# EAGLE design beemos-master (EAGLE 9.0.0)
DELETE: MF
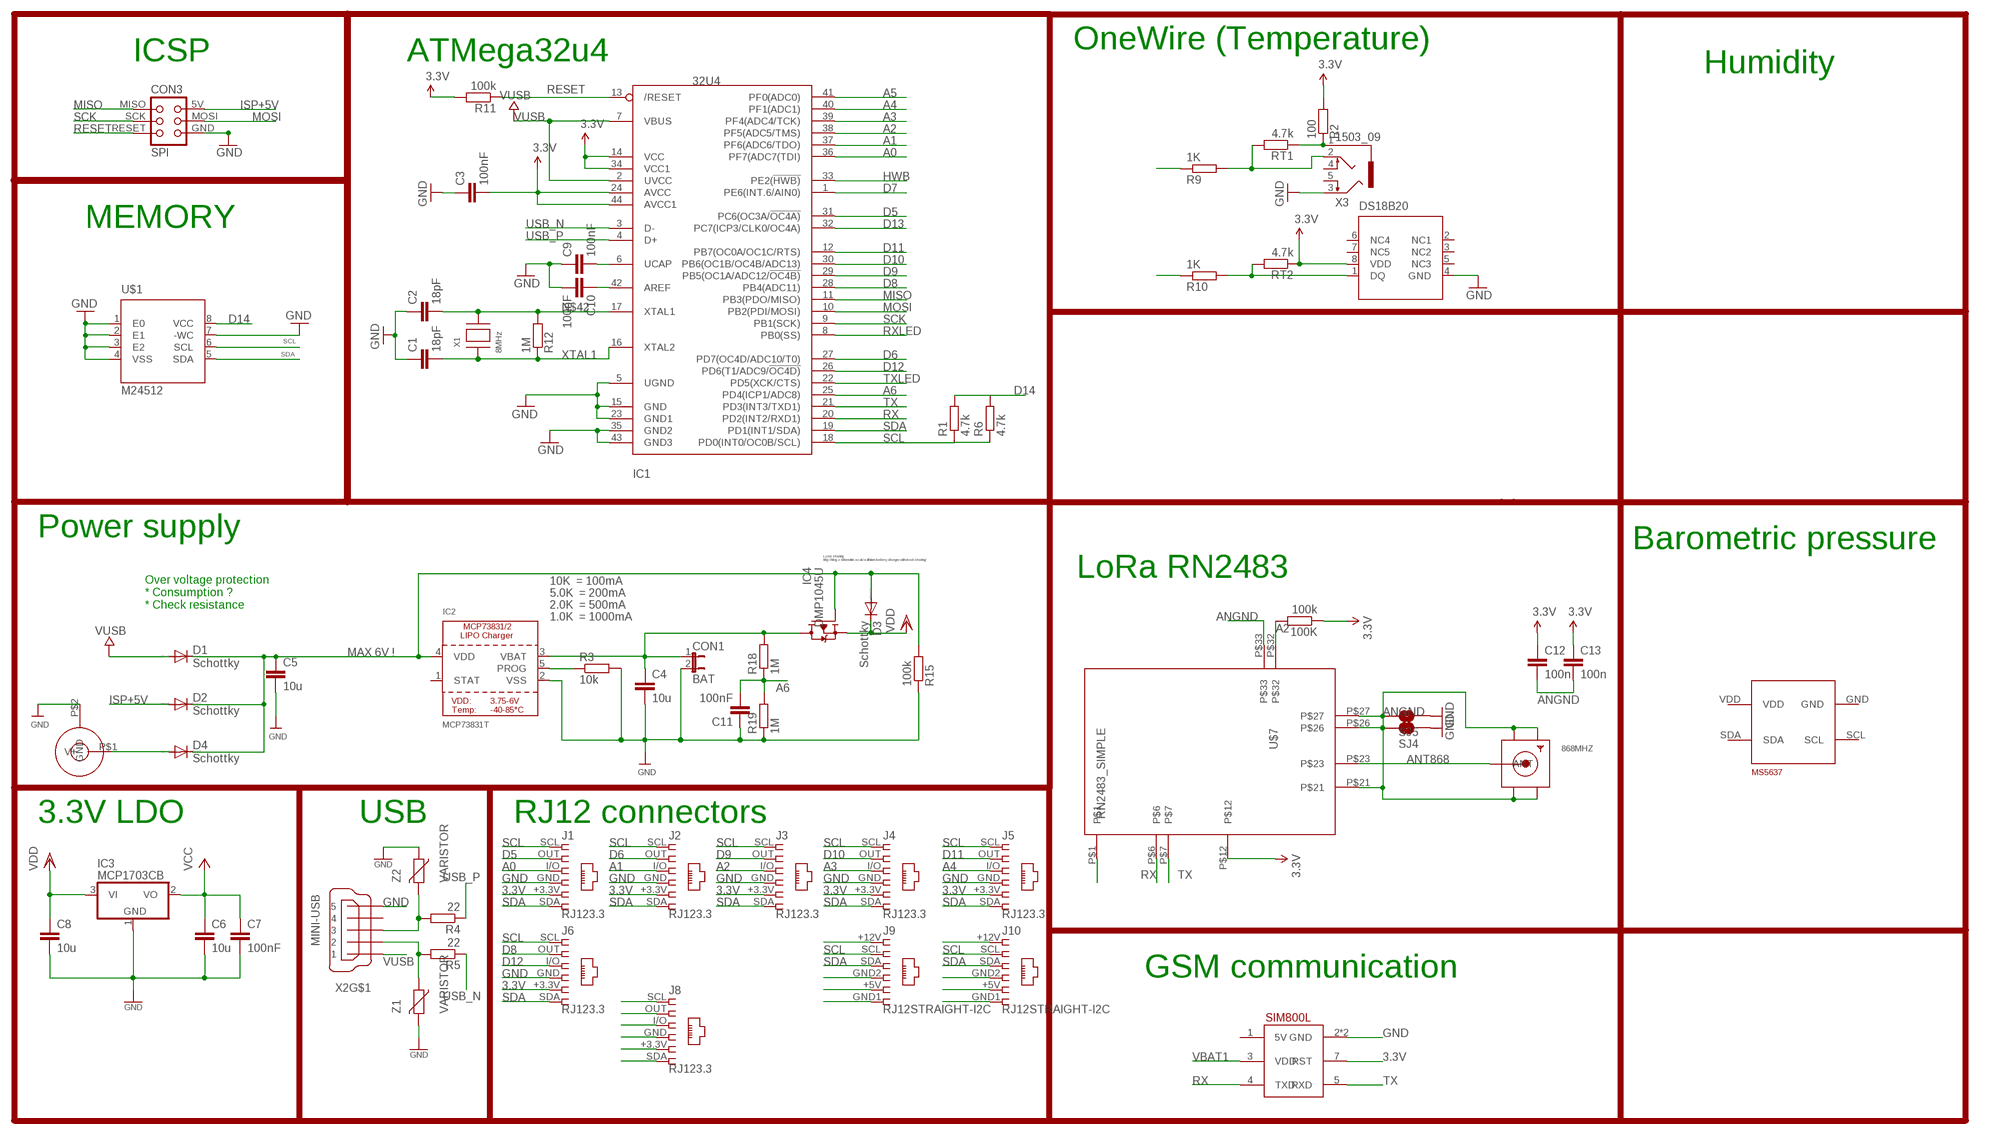
[diagram p0: schematic, sheet 1]

## Parts
100K  100k  R-EU_R0805  [R0805]
868MHZ  SMACONNECTOR_EDGE_UFL  [SMA_EDGELAUNCH_UFL]
C1  18pF  C-EUC0805K  [C0805K]
C2  18pF  C-EUC0805K  [C0805K]
C3  100nF  C-EUC0805K  [C0805K]
C4  10u  C-EUC0805K  [C0805K]
C5  10u  C-EUC0805K  [C0805K]
C6  10u  C-EUC0805K  [C0805K]
C7  100nF  C-EUC0805K  [C0805K]
C8  10u  C-EUC0805K  [C0805K]
C9  100nF  C-EUC0805K  [C0805K]
C10  100nF  C-EUC0805K  [C0805K]
C11  100nF  C-EUC0805K  [C0805K]
C12  100n  C-EUC0805  [C0805]
C13  100n  C-EUC0805  [C0805]
CON1  BAT  JP1E  [JP1]
CON2  JACK_DC_BARREL  [DC_BARREL]
CON3  SPI  TINYISPT  [TC2030-MCP-NL]
D1  Schottky  MBR0520LT  [SOD123]
D2  Schottky  MBR0520LT  [SOD123]
D3  Schottky  MBR0520LT  [SOD123]
D4  Schottky  MBR0520LT  [SOD123]
IC1  32U4  ATMEGA32U4-AU  [TQFP44]
IC2  MCP73831T  MCP73831/2  [SOT23-5]
IC3  MCP1703CB  [SOT23]
IC4  DMP1045U  TRANSISTOR_FET_TSM2301CX  [SOT-23]
IC5  MS5637WIDE  [MS5637WIDE]
J1  RJ123.3  [RJ12-STRAIGHT-3.3]
J2  RJ123.3  [RJ12-STRAIGHT-3.3]
J3  RJ123.3  [RJ12-STRAIGHT-3.3]
J4  RJ123.3  [RJ12-STRAIGHT-3.3]
J5  RJ123.3  [RJ12-STRAIGHT-3.3]
J6  RJ123.3  [RJ12-STRAIGHT-3.3]
J8  RJ123.3  [RJ12-STRAIGHT-3.3]
J9  RJ12STRAIGHT-I2C  [RJ12-STRAIGHT-I2C]
J10  RJ12STRAIGHT-I2C  [RJ12-STRAIGHT-I2C]
R1  4.7k  R-EU_R0805  [R0805]
R2  100  R-EU_R0805  [R0805]
R3  10k  R-EU_R0805  [R0805]
R4  22  R-EU_R0805  [R0805]
R5  22  R-EU_R0805  [R0805]
R6  4.7k  R-EU_R0805  [R0805]
R9  1K  R-EU_R0805  [R0805]
R10  1K  R-EU_R0805  [R0805]
R11  100k  R-EU_R0805  [R0805]
R12  1M  R-EU_R0805  [R0805]
R15  100k  R-EU_R0805  [R0805]
R18  1M  R-EU_R0805  [R0805]
R19  1M  R-EU_R0805  [R0805]
RT1  4.7k  R-EU_R0805  [R0805]
RT2  4.7k  R-EU_R0805  [R0805]
SJ4  JUMPER-PAD-2-NC_BY_TRACE  [PAD-JUMPER-2-NC_BY_TRACE_YES_SILK]
SJ5  JUMPER-PAD-2-NC_BY_TRACE  [PAD-JUMPER-2-NC_BY_TRACE_YES_SILK]
U$1  M24512  [SO8]
U$6  SIM800L  [SIP]
U$7  RN2483_SIMPLE  [RN2483_SIMPLE]
U$8  DS18B20  DS18B20SMALL  [MSOP8]
X1  8MHz  XTALNX6035  [NX6035]
X2  MINI-USB  MINI-USB-SCHIELD-32005-201  [32005-201]
X3  1503_09  [1503_09]
Z1  VARISTOR  VARISTORCN0805  [CT/CN0805]
Z2  VARISTOR  VARISTORCN0805  [CT/CN0805]

## Nets
3.3V [power]: 100K.1 C3.2 C6.1 C7.1 C12.1 C13.1 IC1.14(VCC) IC1.24(AVCC) IC1.34(VCC1) IC1.44(AVCC1) IC3.2(VO) J1.+3.3V J2.+3.3V J3.+3.3V J4.+3.3V J5.+3.3V J6.+3.3V R2.2 R11.2 RT2.1 U$6.7(RST) U$7.P$12 U$8.8(VDD) ; supply symbol labelled VCC
A0: IC1.36(PF7(ADC7(TDI)) J1.I/O
A1: IC1.37(PF6(ADC6/TDO)) J2.I/O
A2: 100K.2 IC1.38(PF5(ADC5/TMS)) J3.I/O U$7.P$32
A3: IC1.39(PF4(ADC4/TCK)) J4.I/O
A4: IC1.40(PF1(ADC1)) J5.I/O
A5: IC1.41(PF0(ADC0))
A6: C11.2 IC1.25(PD4(ICP1/ADC8)) R18.1 R19.2
A7: R9.1
ANGND: 868MHZ.GND@1(GND1) 868MHZ.GND@2(GND2) 868MHZ.GND@3(GND3) 868MHZ.GND@4(GND4) C12.2 C13.2 SJ4.2 SJ5.2 U$7.P$1 U$7.P$21 U$7.P$26 U$7.P$27 U$7.P$33
ANT868: 868MHZ.P(ANT) U$7.P$23
AREF: C10.1 IC1.42(AREF)
D5: IC1.31(PC6(OC3A/!OC4A)) J1.OUT
D6: IC1.27(PD7(OC4D/ADC10/T0)) J2.OUT
D7: IC1.1(PE6(INT.6/AIN0))
D8: IC1.28(PB4(ADC11)) J6.OUT
D9: IC1.29(PB5(OC1A/ADC12/!OC4B)) J3.OUT
D10: IC1.30(PB6(OC1B/OC4B/ADC13)) J4.OUT
D11: IC1.12(PB7(OC0A/OC1C/RTS)) J5.OUT
D12: IC1.26(PD6(T1/ADC9/!OC4D)) J6.I/O
D12*: R10.1
D13: IC1.32(PC7(ICP3/CLK0/OC4A))
D14 [power]: R1.2 R6.2 U$1.8(VCC)
GND [power]: C1.1 C2.1 C3.1 C4.2 C5.2 C6.2 C7.2 C8.2 C9.1 C10.2 C11.1 CON1.2 CON2.P$2(GND) CON3.GND IC1.5(UGND) IC1.15(GND) IC1.23(GND1) IC1.35(GND2) IC1.43(GND3) IC2.2(VSS) IC3.1(GND) J1.GND J2.GND J3.GND J4.GND J5.GND J6.GND R3.2 R15.1 R19.1 SJ4.1 SJ5.1 U$1.1(E0) U$1.2(E1) U$1.3(E2) U$1.4(VSS) U$1.7(-WC) U$6.2(GND) U$6.6(GND) U$8.4(GND) X2.5 X3.3 Z1.2 Z2.1
HWB: IC1.33(PE2(!HWB))
ISP+5V: CON3.5V(VCC) D2.A
MISO: CON3.MISO IC1.11(PB3(PDO/MISO))
MOSI: CON3.MOSI IC1.10(PB2(PDI/MOSI))
N$1: C9.2 IC1.6(UCAP)
N$3: CON2.P$1(V+) D4.A
N$6: IC2.5(PROG) R3.1
N$9 [power]: R10.2 RT2.2 U$8.1(DQ)
N$14 [power]: R2.1 RT1.1 X3.1
N$15: C5.1 D1.C D2.C D3.A D4.C IC2.4(VDD) IC4.1(G) R15.2
N$21 [power]: R9.2 RT1.2 X3.2
N$27: J8.SCL
N$28: J8.OUT
N$29: J8.I/O
N$30: J8.GND
N$31: J8.+3.3V
N$32: J8.SDA
N$33: J9.+12V
N$36: J9.GND2
N$37: J9.+5V
N$40: J9.GND1
N$42: C2.2 IC1.17(XTAL1) R12.2 X1.P$2
N$44: J10.+12V
N$47: J10.GND2
N$48: J10.+5V
N$49: J10.GND1
RESET: CON3.RESET IC1.13(/RESET) R11.1
RX: IC1.20(PD2(INT2/RXD1)) U$6.4(TXD) U$7.P$6
RXLED: IC1.8(PB0(SS))
SCK: CON3.SCK IC1.9(PB1(SCK))
SCL: IC1.18(PD0(INT0/OC0B/SCL)) J1.SCL J2.SCL J3.SCL J4.SCL J5.SCL J6.SCL J9.SCL J10.SCL R1.1 R6.1 U$1.6(SCL)
SDA: IC1.19(PD1(INT1/SDA)) J1.SDA J2.SDA J3.SDA J4.SDA J5.SDA J6.SDA J9.SDA J10.SDA U$1.5(SDA)
TX: IC1.21(PD3(INT3/TXD1)) U$6.5(RXD) U$7.P$7
TXLED: IC1.22(PD5(XCK/CTS))
USB_N: IC1.3(D-) R5.1
USB_P: IC1.4(D+) R4.1
USBC_N: R5.2 X2.2 Z1.1
USBC_P: R4.2 X2.3 Z2.2
VBAT1: C4.1 CON1.1 IC2.3(VBAT) IC4.3(D) R18.2 U$6.3(VDD)
VDD [power]: C8.1 D3.C IC3.3(VI) IC4.2(S)
VUSB: D1.A IC1.2(UVCC) IC1.7(VBUS) X2.1
XTAL1: C1.2 IC1.16(XTAL2) R12.1 X1.P$1
Unconnected: IC2.1(STAT) IC5.GND IC5.SCL IC5.SDA IC5.VDD U$6.1(5V) U$8.2(NC1) U$8.3(NC2) U$8.5(NC3) U$8.6(NC4) U$8.7(NC5) X2.4 X2.M1(S:S1) X2.M2(S:S2) X2.M3(S:S3) X2.M4(S:S4) X3.4 X3.5

## Notes on the sheet
- OneWire (Temperature)
- ICSP | ATMega32u4
- Humidity
- MEMORY
- Power supply
- Barometric pressure
- Load sharing:
  http://blog.zakkemble.co.uk/a-lithium-battery-charger-with-load-sharing/
- LoRa RN2483
- 10K  = 100mA
- 5.0K  = 200mA
- Over voltage protection
  * Consumption ?
  * Check resistance
- 2.0K  = 500mA
- 1.0K  = 1000mA
- MAX 6V !
- 3.3V LDO | USB | RJ12 connectors
- GSM communication

## Library data of the parts
100K R1 R2 R6 R9 R10 = rcl:R-EU_: RESISTOR, European symbol
868MHZ = sma_end_launch:SMACONNECTOR: SMA Connector 90° DIP SMA Connector, 50 Ohm (4UConnector: 07259)
C1 C2 = rcl:C-EU: CAPACITOR, European symbol; ELECROW: C1797; LCSC: C1797; MPN: 77-VJ1206A180JXXPBC; SPICEPREFIX: C
C3 C7 C9-C11 = rcl:C-EU: CAPACITOR, European symbol; ELECROW: C49678; LCSC: C49678; MPN: 80-C1206C104K5R; SPICEPREFIX: C
C4-C6 C8 = rcl:C-EU: CAPACITOR, European symbol; ELECROW: C15850; LCSC: C15850; MPN: 77-VJ1206V106ZXQTBC; SPICEPREFIX: C
C12 C13 = rcl:C-EU: CAPACITOR, European symbol
CON1 = jumper:JP1E: JUMPER
CON2 = lpatiny:JACK_DC_BARREL
CON3 = lpatiny:TINYISP: CONNECTOR
D1-D4 = diode:MBR0520LT: SCHOTTKY BARRIER RECTIFIER Source: http://onsemi.com .. MBR0520LT1-D.pdf; LCSC: C82544; MPN: 621-1N5819HW-F
IC1 = adafruit:ATMEGA32U4: http://www.ladyada.net/library/eagle; LCSC: C44854; MPN: 556-ATMEGA32U4RC-AU
IC2 = microbuilder:MCP73831/2: MCP73831/2 LIPO Charger VDD: 3.75 - 6V Temp -40 - 85°C Programmable Charge Rate: 15-500mA NOTE: STAT is a tri-state logic output on the MCP73831 and an open-drain output on the MCP73832. SOT23-5 with 4.2V output and tri-state logic on STAT = MCP73831T-2ACI/OT; LCSC: C14879; MPN: 579-MCP73831T-3ACIOT
IC3 = linear:MCP1703: 250 mA, 16V, Low Quiescent Current LDO Regulator Source: http://ww1.microchip.com/downloads/en/DeviceDoc/22049b.pdf; LCSC: C53352
IC4 = dp_devices:TRANSISTOR_FET_TSM2301CX: 20V P-Channel Enhancement Mode MOSFET; LCSC: C96613; MPN: 621-DMP1045U-7
IC5 = MS5637:MS5637: Le MS563702BA03-50 est un Micro Altimètre ultra compact optimisé pour des applications d'altimètre et de baromètre dans des téléphones portables et des tablettes. La résolution d'altitude au niveau de la mer est de 13cm d'air. Le module de capteur comprend un capteur de pression haute linéarité et un CAN ΔΣ 24 bits ultra faible puissance avec des coefficients internes calibrés en usine. Il fournit une valeur numérique de pression et de température précise de 24 bits et différents modes de fonctionnement qui permettent à l'utilisateur d'optimiser la vitesse de conversion et la consommation de courant. La sortie de température à haute résolution permet la mise en œuvre d'une fonction altimètre / thermomètre sans capteur supplémentaire. Il peut être interfacé avec pratiquement tous les microcontrôleurs à interface I²C-bus. Le protocole de communication est simple, sans avoir à programmer des registres internes dans l'appareil. Faibles dimensions de 3 x 3 x 0.9mm³ pour une intégratio Module haute résolution, 13cm Capteur de pression numérique intégré (CAN ΔΣ 24 bits) Interface I²C Plage de pression étendue de 10 à 2000mbar Conversion rapide jusqu'à 0.5ms Faible consommation, 0.6µA (veille <=0.1µA à 25°C) Aucun composant externe (oscillateur interne)
J1-J6 J8-J10 = lpatiny:RJ12: CORCOM Modular RJ Jacks No Shield Source: www.tycoelectronics.com .. ENG_DS_1654001_1099_RJ_L_0507.pdf
R3 = rcl:R-EU_: RESISTOR, European symbol; ELECROW: C17414; LCSC: C17414
R4 = rcl:R-EU_: RESISTOR, European symbol; ELECROW: C17561; LCSC: C17561
R5 = rcl:R-EU_: RESISTOR, European symbol; ELECROW: C17561; LCSC: C17561; SPICEPREFIX: R
R11 = rcl:R-EU_: RESISTOR, European symbol; ELECROW: C17407; LCSC: C17407; MPN: RC1206FR-07100KL; SPICEPREFIX: R
R12 R18 R19 = rcl:R-EU_: RESISTOR, European symbol; ELECROW: C17514; LCSC: C17514
R15 = rcl:R-EU_: RESISTOR, European symbol; ELECROW: C17407; LCSC: C17407; MPN: RC1206FR-07100KL
RT1 RT2 = resistor:R-EU_: RESISTOR, European symbol
SJ4 SJ5 = SparkFun-Passives:JUMPER-PAD-2-NC_BY_TRACE
U$1 = lpatiny:M24512
U$6 = SIM800L:SIM800L: SIM800L Blue EVB Board with Level Translation and diode dropper.
U$7 = Octanis1_bioreactorPort:RN2483_SIMPLE
U$8 = lpatiny:DS18B20
X1 = lpatiny:XTAL: Low cost SMT crystals, no capacitors included http://www.ladyada.net/library/eagle; LCSC: C122522; MPN: 729-F60800010
X2 = con-cypressindustries:MINI-USB-SCHIELD-: MINI USB-B Conector Source: www.cypressindustries.com; LCSC: C46391; MPN: 649-10033526-N3212LF
X3 = con-lumberg:1503_09: Jack connectors according to JISC 6560, 3.5 mm Klinkeneinbaukupplung nach JISC 6560, 3,5 mm, 3-polig/ stereo, abgewinkelte Ausführung, mit 2 Öffnern und Lötaugen, für Leiterplatten Rückseitenmontage Source: http://www.lumberg.com/Produkte/PDFs/1503_09.pdf; OC_FARNELL: 1243244; OC_NEWARK: unknown
Z1 Z2 = varistor:VARISTOR: VARISTOR; LCSC: C79709

## Net classes
0 default: width 0.203 mm, clearance 0.25 mm
1 power: width 0.203 mm, drill 0.305 mm, clearance 0.25 mm
2 VIN: width 0.406 mm, clearance 0.25 mm
3 fine: width 0.406 mm, clearance 0.25 mm
4 aref: width 0.406 mm, clearance 0.25 mm

## Board
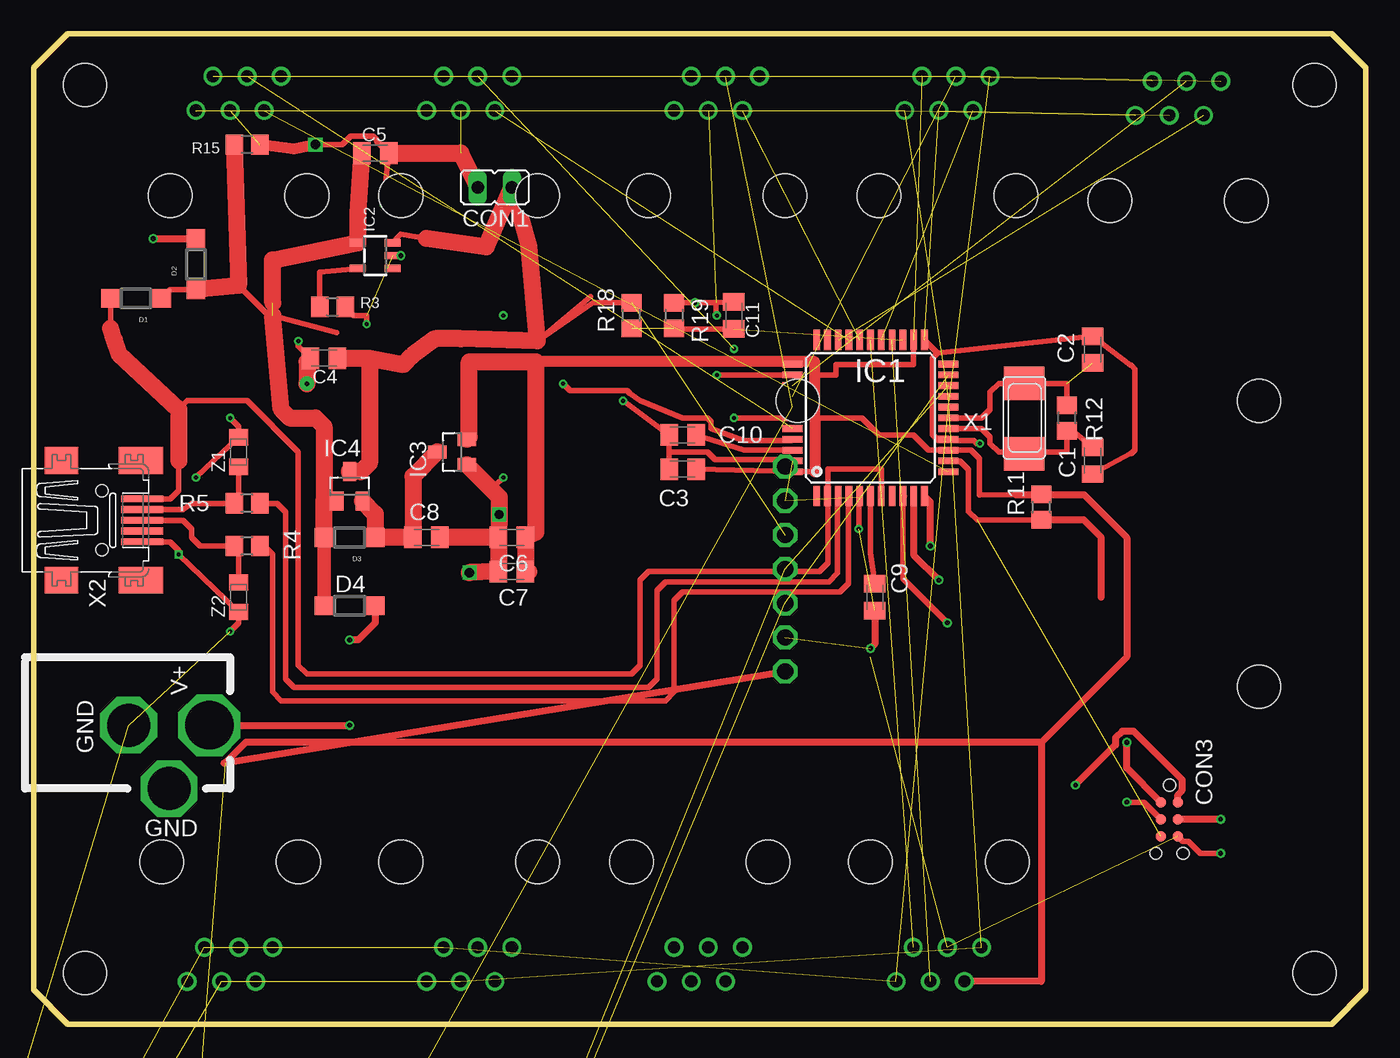
[diagram p1: board, top side]
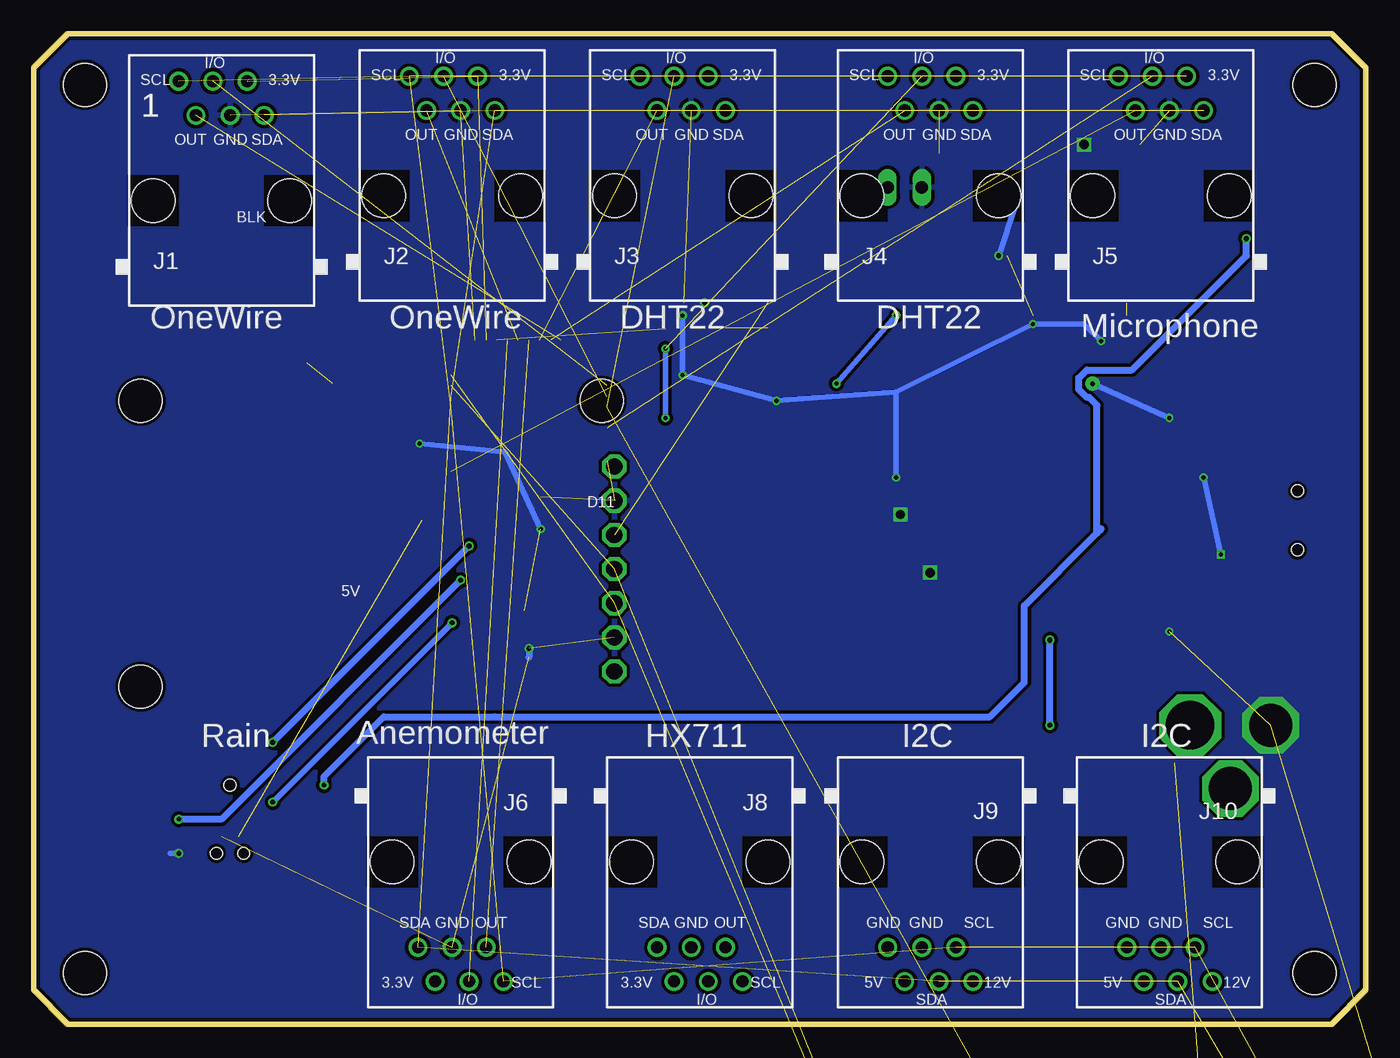
[diagram p2: board, bottom side, seen from below]

Size 99.06 x 73.66 mm. Coordinates in mm from the lower left corner, seen from the top.
Outline: 99.06,71.12 99.06,2.54 96.52,0 2.54,0 0,2.54 0,71.12 2.54,73.66 96.52,73.66 99.06,71.12
Copper layers (1*16): Top 0.035mm / dielectric 0.2mm / Bottom 0.035mm
Design rules "SeeedStudio_DRU_no_angle_20130527 *": minimum track width 6mil, minimum drill 12mil, track to track 6mil, track to pad 6mil, pad to pad 6mil, via to via 6mil, smd to smd 0mil, copper to edge 10mil, drill to drill 10mil, minimum pad ring 6mil, minimum via ring 6mil, stop-mask expansion 2mil, vias tented up to drill 25mil, thermal gap 10mil
Holes 3.2 mm at 95.25,69.85 95.25,3.81 3.81,69.85 3.81,3.81

### Footprints (pad centres in the part's own frame; a part is rotated, then mirrored left to right if it is on the bottom)
R0805 = smd 1.3 x 1.5: 1 -0.95,0; 2 0.95,0
SMA_EDGELAUNCH_UFL = smd 4.064 x 1.524: GND@1 2.032,-2.54; GND@2 2.032,2.54 | smd 4.064 x 1.524 bottom: GND@3 2.032,2.54; GND@4 2.032,-2.54 | smd 2.032 x 1.016: P 3.048,0
C0805K = smd 1.3 x 1.6: 1 -1,0; 2 1,0
C0805 = smd 1.3 x 1.5: 1 -0.95,0; 2 0.95,0
JP1 = drill 0.914 long: 1 0,-1.27; 2 0,1.27
DC_BARREL = drill 3.6 pad 4.5 octagon: P$1 0,13.7 | drill 3.2 pad 4.064 octagon: P$2 0,7.7; P$3 4.7,10.7
TC2030-MCP-NL = smd 0.787 x 0.787: 5V 1.27,0.635; GND 3.81,0.635; MISO 1.27,-0.635; MOSI 2.54,0.635; RESET 3.81,-0.635; SCK 2.54,-0.635 | hole 0.889: 0,0; 5.08,-1.016; 5.08,1.016
SOD123 = smd 1.4 x 1.4: A 1.9,0; C -1.9,0
TQFP44 = smd 1.5 x 0.5: 1 -5.8,4; 2 -5.8,3.2; 3 -5.8,2.4; 4 -5.8,1.6; 5 -5.8,0.8; 6 -5.8,0; 7 -5.8,-0.8; 8 -5.8,-1.6; 9 -5.8,-2.4; 10 -5.8,-3.2; 11 -5.8,-4; 23 5.8,-4; 24 5.8,-3.2; 25 5.8,-2.4; 26 5.8,-1.6; 27 5.8,-0.8; 28 5.8,0; 29 5.8,0.8; 30 5.8,1.6; 31 5.8,2.4; 32 5.8,3.2; 33 5.8,4 | smd 0.5 x 1.5: 12 -4,-5.8; 13 -3.2,-5.8; 14 -2.4,-5.8; 15 -1.6,-5.8; 16 -0.8,-5.8; 17 0,-5.8; 18 0.8,-5.8; 19 1.6,-5.8; 20 2.4,-5.8; 21 3.2,-5.8; 22 4,-5.8; 34 4,5.8; 35 3.2,5.8; 36 2.4,5.8; 37 1.6,5.8; 38 0.8,5.8; 39 0,5.8; 40 -0.8,5.8; 41 -1.6,5.8; 42 -2.4,5.8; 43 -3.2,5.8; 44 -4,5.8
SOT23-5 = smd 0.55 x 1.2: 1 -0.95,-1.3; 2 0,-1.3; 3 0.95,-1.3; 4 0.95,1.3; 5 -0.95,1.3
SOT23 = smd 1 x 1.4: 1 -0.95,-1.1; 2 0.95,-1.1; 3 0,1.1
SOT-23 = smd 1 x 1.4: 1 -0.95,-1.1; 2 0.95,-1.1; 3 0,1.1
MS5637WIDE = smd 1.524 x 1.524: GND 1.254,1.254; SCL 1.254,-1.254; SDA -1.254,-1.254; VDD -1.254,1.254
RJ12-STRAIGHT-3.3 = drill 0.9 pad 1.4: +3.3V 1.905,8.89; GND 0.635,6.35; I/O -0.635,8.89; OUT -1.905,6.35; SCL -3.175,8.89; SDA 3.175,6.35 | hole 3.251: -5.08,0; 5.08,0
RJ12-STRAIGHT-I2C = drill 0.9 pad 1.4: +5V 1.905,8.89; +12V -3.175,8.89; GND1 3.175,6.35; GND2 0.635,6.35; SCL -1.905,6.35; SDA -0.635,8.89 | hole 3.251: -5.08,0; 5.08,0
PAD-JUMPER-2-NC_BY_TRACE_YES_SILK = smd 0.635 x 1.27: 1 -0.508,0; 2 0.508,0
SO8 = smd 0.66 x 2.032: 1 -3.81,-3.073; 2 -2.54,-3.073; 3 -1.27,-3.073; 4 0,-3.073; 5 0,3.073; 6 -1.27,3.073; 7 -2.54,3.073; 8 -3.81,3.073
SIP = drill 1.2 octagon: 1 38.1,19.24; 2 38.1,16.7; 3 38.1,14.16; 4 38.1,11.62; 5 38.1,9.08; 6 38.1,6.54; 7 38.1,4 | hole 3.2: 2.87,24.13; 2.87,2.87; 37.16,24.13
RN2483_SIMPLE = smd 1.524 x 1.016: P$1 8.89,-11.43; P$6 8.89,-5.08; P$7 8.89,-3.81; P$12 8.89,2.54; P$32 -8.89,7.62; P$33 -8.89,8.89 | smd 1.016 x 1.524: P$21 3.81,13.97; P$23 1.27,13.97; P$26 -2.54,13.97; P$27 -3.81,13.97
MSOP8 = smd 0.45 x 1: 1 -0.975,-2.05; 2 -0.325,-2.05; 3 0.325,-2.05; 4 0.975,-2.05; 5 0.975,2.05; 6 0.325,2.05; 7 -0.325,2.05; 8 -0.975,2.05
NX6035 = smd 2.5 x 3: P$1 2.665,0; P$2 -2.565,0
32005-201 = smd 3.1 x 0.5: 1 3,1.6; 2 3,0.8; 3 3,0; 4 3,-0.8; 5 3,-1.6 | smd 2.5 x 2: M1 -3,-4.45; M2 -3,4.45 | smd 3.3 x 2: M3 2.9,4.45; M4 2.9,-4.45 | hole 0.9: 0,2.2; 0,-2.2
1503_09 = drill 0.8 pad 1.2 long: 1 0,-2.1; 2 -4.55,-5.4; 3 5.05,-9.9; 4 -4,-13.1; 5 2.65,-8.5
CT/CN0805 = smd 1.2 x 1.4: 1 -1.1,0; 2 1.1,0

### Placement (x,y rotation side)
100K  6.99,-99.06 0 top  (outside the outline)
868MHZ  -4.45,-103.5 0 top  (outside the outline)
C1  78.74,41.91 90 top
C2  78.74,50.16 270 top
C3  48.26,41.27 0 top
C4  21.59,49.53 180 top
C5  25.4,64.77 0 top
C6  35.56,36.2 180 top
C7  35.56,33.66 180 top
C8  29.21,36.2 0 top
C9  62.55,31.75 90 top
C10  48.26,43.81 180 top
C11  52.07,52.7 270 top
C12  13.34,-99.06 0 top  (outside the outline)
C13  -11.43,-114.94 0 top  (outside the outline)
CON1  34.29,62.23 90 top
CON2  -0.64,22.23 270 top
CON3  84.45,17.78 270 top
D1  7.62,53.98 180 top
D2  12.06,56.52 90 top
D3  23.5,36.2 180 top
D4  23.5,31.11 0 top
IC1  62.23,45.09 90 top
IC2  25.4,57.15 90 top
IC3  31.11,42.55 90 top
IC4  23.5,40.01 0 top
IC5  -10.16,-156.21 0 top  (outside the outline)
J1  85.09,61.23 0 bottom
J2  67.94,61.59 0 bottom
J3  50.8,61.59 0 bottom
J4  32.38,61.59 0 bottom
J5  15.24,61.59 0 bottom
J6  67.31,12.06 180 bottom
J8  49.53,12.06 180 bottom
J9  32.38,12.06 180 bottom
J10  14.61,12.06 180 bottom
R1  -11.43,-57.15 0 top  (outside the outline)
R2  5.71,-150.5 0 top  (outside the outline)
R3  22.23,53.34 0 top
R4  15.88,35.56 180 top
R5  15.88,38.73 180 top
R6  -11.43,-63.5 0 top  (outside the outline)
R9  10.79,-150.5 0 top  (outside the outline)
R10  0,-150.5 0 top  (outside the outline)
R11  74.93,38.44 90 top
R12  76.83,45.09 90 top
R15  15.88,65.41 180 top
R18  44.45,52.7 90 top
R19  47.62,52.7 270 top
RT1  -11.43,-150.5 0 top  (outside the outline)
RT2  -5.71,-150.5 0 top  (outside the outline)
SJ4  -6.35,-113.67 0 top  (outside the outline)
SJ5  -3.17,-113.67 0 top  (outside the outline)
U$1  -6.99,-35.56 0 top  (outside the outline)
U$6  93.98,22.23 0 bottom
U$7  -2.54,-83.19 0 top  (outside the outline)
U$8  11.43,-123.19 0 top  (outside the outline)
X1  73.66,45.09 270 top
X2  5.08,37.47 0 top
X3  -3.17,-127.64 0 top  (outside the outline)
Z1  15.24,42.55 90 top
Z2  15.24,31.75 90 top

### Tracks (layer width: path | path; a pad name or v marks a point on that pad's centre or on a via)
3.3V  (12 unrouted)
  Top 0.406: R11.2 73.03,39.37 70.32,39.34 70.32,42.05 69.69,42.69 IC1.14 66.53,42.69 65.41,43.81 62.87,43.81 61.59,45.09 58.08,45.09 | 58.12,42.55 58.08,41.09 IC1.44 C3.2 | 58.12,42.55 58.26,48.26 | 58.26,48.26 58.26,49.09 IC1.34 | IC1.24 65.41,50.88 65.41,49.06 59.66,49.06 59.66,48.26 58.26,48.26 | 58.25,42.69 58.12,42.55
  Top 0.508: 73.03,39.37 78.1,39.37 81.28,36.2 81.28,27.3 74.93,20.95 | U$6.7 14.14,19.41 14.23,19.41 15.77,20.95 74.93,20.95 | 74.93,20.95 74.93,3.17 J6.+3.3V
  Top 0.813: 37.34,49.26 58.08,49.26 58.08,45.09 58.08,41.09
  Top 1.27: 36.83,33.66 C7.1 C6.1 37.34,36.57 37.34,49.26 32.38,49.26 32.38,43.66 IC3.2 | 74.93,39.37 R11.2
A0  (1 unrouted)
A1  (1 unrouted)
A2  (3 unrouted)
A3  (via drill 0.3)  (1 unrouted)
  Top 0.406: 52.07,50.16 v52.07,50.22 | v52.07,45.09 IC1.39
  Bottom 0.406: v52.07,50.22 v52.07,45.09
A4  (1 unrouted)
  Top 0.406: 56.43,44.32 IC1.40
A5  (via drill 0.3)
  Top 0.406: IC1.41 56.34,43.39 52.77,43.39 50.36,44.3 50.36,44.8 50.1,45.07 48.28,45.07 48.26,45.09 45.09,46.35 44.33,46.91 44.13,47.11 39.88,47.11 v39.37,47.62
  Bottom 0.406: v39.37,47.62 v34.92,52.7
A6  (2 unrouted)
  Top 0.406: C11.2 47.67,51.7 R19.2
ANGND  (12 unrouted)
ANT868  (1 unrouted)
AREF
  Top 0.406: IC1.42 52.84,42.69 C10.1
D5  (1 unrouted)
  Top 0.406: IC1.31 59.82,50.88
D6  (1 unrouted)
D8  (1 unrouted)
D9  (1 unrouted)
D10  (1 unrouted)
D11  (1 unrouted)
D12  (1 unrouted)
D14  (2 unrouted)
GND  (via drill 0.3, 0.35, 0.35 pad 1.05, 0.7)  (22 unrouted)
  Top 0.406: 34.29,36.2 C6.2 | C7.2 34.29,33.66 | X2.5 10.16,35.87 10.79,35.23 v10.79,34.92 Z2.1 15.24,29.84 v14.61,29.21 | IC1.35 52.07,48.28 | 52.07,48.28 51.76,48.28 | 66.2,50.88 IC1.23 67.22,49.9 | R19.1 v49.17,53.66 50.75,53.66 | C11.1 50.75,53.66 | IC2.2 v27.3,57.15 | v14.61,45.09 15.24,44.45 Z1.2 v12.06,40.64 | C1.1 81.54,42.44 81.63,42.44 81.9,42.71 81.9,48.73 81.63,49 81.54,49 C2.1 67.22,49.9 | IC1.15 67.93,43.58 67.09,43.58 | 67.09,43.58 66.83,43.85 66.83,49.52 67.09,49.79 67.11,49.79 67.22,49.9 | 67.09,43.58 67.29,43.39 69.91,43.39 70.12,43.18 v70.36,43.18 70.46,43.18 | v61.35,36.83 61.35,39.2 IC1.5 | 50.75,53.66 50.75,52.76 v50.8,52.7 | v50.8,48.26 52.05,48.26 52.07,48.28 | R3.2 23.81,52.7 24.77,52.7 v24.77,52.07 | v19.68,50.8 19.68,50.44 C4.2 | v34.92,40.64 34.37,40.08 33.73,40.08 | v43.81,46.35 C10.2 47.26,42.55 | v20.95,65.41 22.94,65.41 23.56,66.02 25.24,66.02 25.5,65.76 25.5,65.67 C5.2 v26.04,60.96 | 47.26,42.55 C3.1 | 47.26,42.55 47.28,42.53 50.1,42.53 50.65,41.98 56.34,41.98 IC1.43 | CON3.GND 85.46,13.6 85.84,13.6 86.75,12.7 v88.27,12.7
  Top 0.508: C9.1 62.55,28.26 v62.23,27.94
  Top 0.813: v20.95,65.41 19.36,65.08 R15.1
  Top 1.27: C6.2 v34.61,37.9 34.61,39.2 33.73,40.08 IC3.1 | C6.2 C8.2 | C6.2 C7.2 | 34.29,33.66 v32.4,33.59 | C5.2 31.75,64.77 CON1.2 | C4.2 20.32,49.26 v20.32,47.62
  Bottom 0.406: v70.36,43.18 64.01,42.55 v61.35,36.83 | v50.8,52.7 v50.8,48.26 v43.81,46.35 34.92,46.99 | v19.68,50.8 20.95,52.07 v24.77,52.07 34.92,46.99 | 34.92,46.99 v34.92,40.64 | v14.61,45.09 v20.32,47.62 | v12.06,40.64 v10.79,34.92 | v26.04,60.96 v27.3,57.15 | v88.27,12.7 88.9,12.7
  Bottom 0.508: v62.23,27.94 62.23,27.3
  pour Bottom: 99.06,71.12 99.06,2.54 96.52,0 2.54,0 0,2.54 0,71.12 2.54,73.66 96.52,73.66
HWB
  Top 0.406: 58.23,50.99 IC1.33
ISP+5V  (via drill 0.35)
  Top 0.508: v8.89,58.42 D2.A | CON3.5V 85.09,17.07 85.41,17.39 85.41,18.18 81.8,21.79 80.94,21.79 80.45,21.3 80.45,20.76 v77.47,17.78
  Bottom 0.508: 20,36.51 19.68,36.83 | 20,36.51 20,46.04 20.56,46.6 20.75,46.6 21.35,47.2 21.35,48.05 20.75,48.65 17.39,48.65 8.89,57.15 v8.89,58.42 | 20,36.51 25.4,31.11 25.4,25.4 27.94,22.86 64.14,22.86 64.77,22.86 73.03,22.86 77.47,18.41 v77.47,17.78
MISO  (via drill 0.35)
  Top 0.508: CON3.MISO 81.28,19.05 v81.28,20.95 | v66.67,35.56 66.67,38.84 IC1.11
  Bottom 0.508: v81.28,20.95 v66.67,35.56
MOSI  (via drill 0.35)
  Top 0.508: v67.31,33.02 65.43,34.9 IC1.10 | v88.27,15.24 CON3.MOSI
  Bottom 0.508: v67.31,33.02 CON3.MOSI v88.27,15.24
N$1
  Top 0.406: C9.2 62.23,35.05 IC1.6
N$3  (via drill 0.35)
  Top 0.508: D4.A 25.39,29.84 24.13,28.57 v23.5,28.57 | CON2.P$1 v23.5,22.23
  Bottom 0.508: v23.5,22.23 v23.5,28.57
N$6
  Top 0.406: IC2.5 21.27,55.91 R3.1
N$9  (2 unrouted)
N$14  (2 unrouted)
N$15  (1 unrouted)
  Top 0.406: 22,38.91 IC4.1 | 22.54,51.44 17.78,52.7 17.46,52.7 15.24,54.93 | D1.C 10.16,54.62 D2.C
  Top 1.016: D3.A D4.C
  Top 1.27: 21.59,38.91 22,38.91 | 21.59,38.91 21.59,44.45 20.95,45.09 19.05,45.09 18.41,45.72 17.78,52.7 | R15.2 15.24,54.93 D2.C | 17.78,53.63 17.76,56.83 IC2.4 24.1,60.33 C5.1 | D3.A 21.59,38.91
N$21  (2 unrouted)
N$42  (1 unrouted)
  Top 0.406: IC1.17 70.48,45.09 71.12,45.72 71.12,46.99 71.75,47.62 73.66,47.62 X1.P$2 76.83,47.65 R12.2
RESET  (1 unrouted)
  Top 0.406: IC1.13 68.89,41.88 69.52,41.25 69.52,38.13 70.16,37.49 R11.1
  Top 0.508: 79.38,31.75 79.38,36.2 78.08,37.49 R11.1
RX  (2 unrouted)
SCK  (via drill 0.35)
  Top 0.406: IC1.9 64.63,33.16 v67.94,29.84 | v81.28,16.51 82.55,16.51 CON3.SCK
  Top 0.508: IC1.9 64.68,39.24
  Bottom 0.406: v67.94,29.84 v81.28,16.51
SCL  (11 unrouted)
SDA  (9 unrouted)
TX  (2 unrouted)
USB_N
  Top 0.406: IC1.3 59.77,39.28 59.77,33.53 59.13,32.9 46.99,32.9 46.35,32.26 46.35,25.68 45.72,25.04 19.37,25.04 18.73,25.68 18.73,38.1 18.1,38.73 R5.1
USB_P
  Top 0.406: R4.1 17.14,35.56 17.78,34.92 17.78,24.69 18.41,24.05 46.99,24.05 47.62,24.69 47.62,31.51 48.26,32.14 59.96,32.14 60.59,32.78 60.59,39.28 IC1.4
USBC_N
  Top 0.406: X2.2 11.12,38.27 11.76,38.73 R5.2 15.24,39.05 Z1.1
USBC_P
  Top 0.406: X2.3 11.12,37.47 11.76,36.83 11.76,36.2 12.39,35.56 R4.2 15.24,35.24 Z2.2
VBAT1  (1 unrouted)
  Top 0.406: IC2.3 27.3,58.73 29.21,58.42 | 41.41,54.1 37.47,50.8 41.59,53.66 R18.2
  Top 1.27: 29.21,58.42 33.66,57.78 CON1.1 36.83,57.78 37.47,50.8 31.75,50.97 29.84,50.97 28.15,49.7 27.52,49.07 24.98,49.53 | 24.98,49.53 24.98,41.73 24.34,41.09 23.5,41.09 IC4.3 | C4.1 24.98,49.53
VDD
  Top 1.27: IC4.2 25.39,37.95 D3.C C8.1 28.21,40.74 IC3.3
VUSB
  Top 0.406: 59.05,39.28 59.05,41.27 63.03,41.27 IC1.7 | IC1.2 59.05,39.28 | 59.05,39.28 59.05,34.29 58.42,33.66 45.72,33.66 45.09,33.02 45.09,26.67 44.45,26.04 20.32,26.04 19.68,26.67 19.68,42.55 15.88,46.35 11.43,46.35 10.79,45.72 | 10.79,41.91 10.79,39.7 10.16,39.06 X2.1 | 6,50.89 5.72,51.17 D1.A
  Top 1.27: 10.79,41.91 10.79,45.72 6.35,49.84 6,50.89 5.71,51.74
XTAL1
  Top 0.406: 73.66,42.55 76.83,42.55 R12.1 77.47,43.95 C1.2 | 73.66,42.55 X1.P$1 | 73.66,42.55 71.75,42.55 71.12,43.18 71.12,43.65 70.48,44.28 IC1.16

### Text on the board
bNames: 1 | BLK | DHT22 | DHT22 | OneWire | OneWire | Microphone | D11 | 5V | Anemometer | I2C | I2C | HX711 | Rain
tValues: GND | + | GND | GND | BeeMoS Master / V1.0
bValues: BeeMoS Master / V 1.0